# Altium schematic sheet BQ25895_Battery_Charger.SchDoc: BQ25895 Battery Charger
size A4; DocumentNumber: 3; SheetNumber: 3; SheetTotal: 50
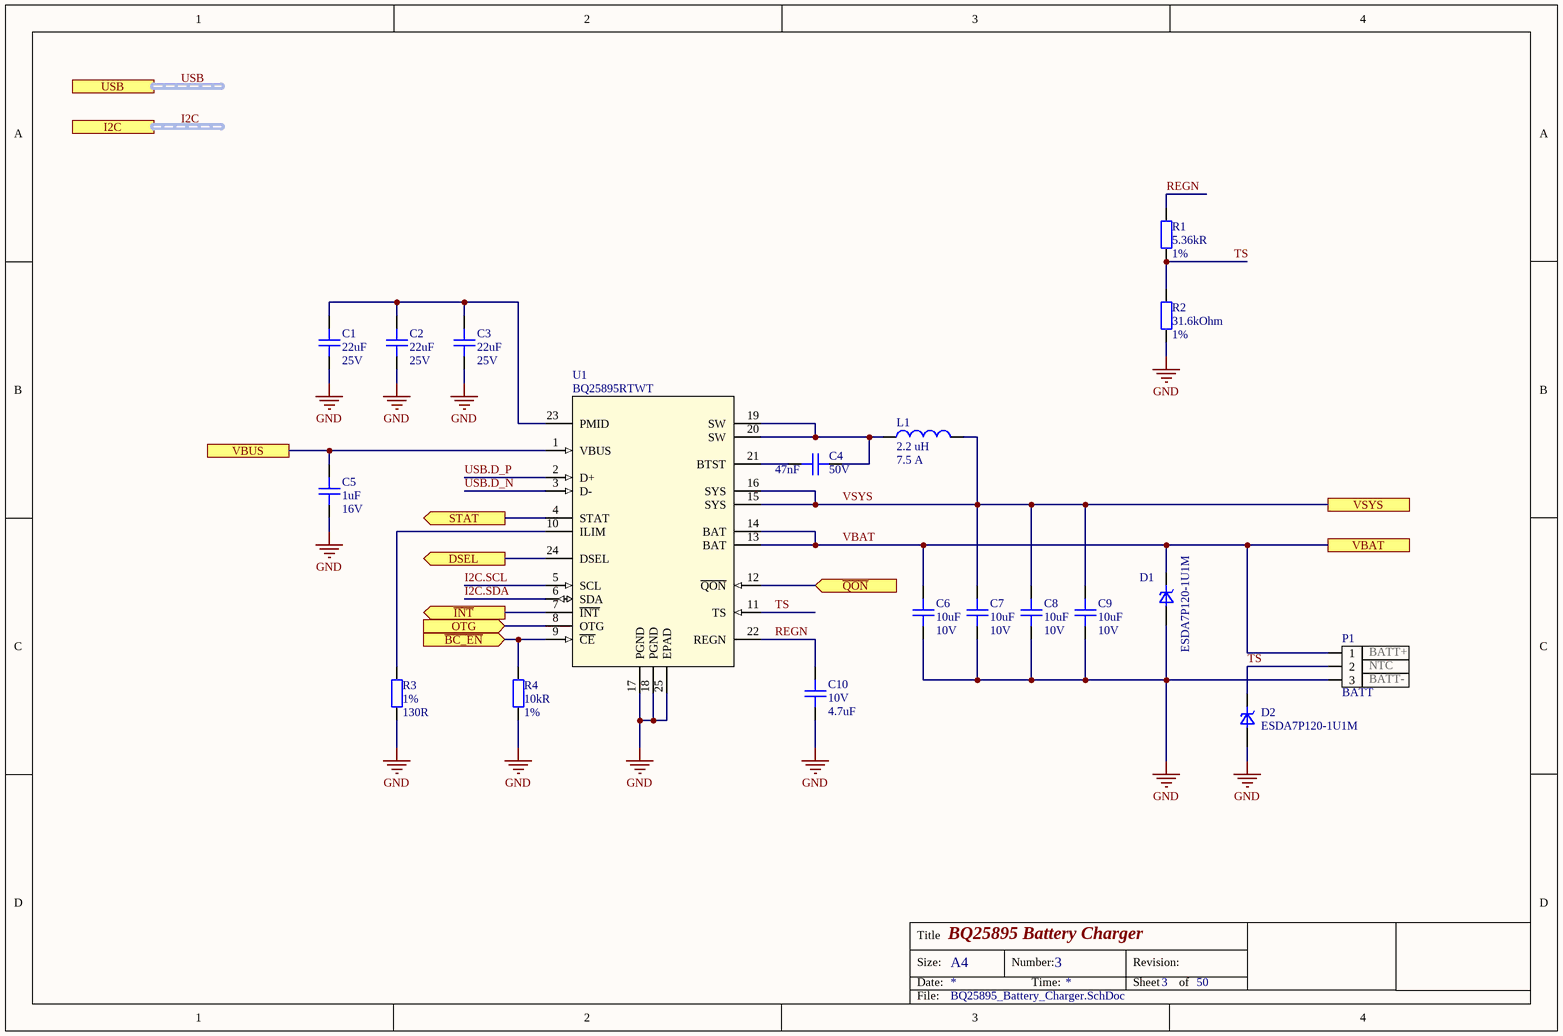
[diagram p0: BQ25895_Battery_Charger.SchDoc]

## Parts
C1  Capacitance: 22uF  Voltage Rating: 25V  [C0805]  (hidden comment: CAP CER 22UF 25V X5R 0805)
C2  Capacitance: 22uF  Voltage Rating: 25V  [C0805]  (hidden comment: CAP CER 22UF 25V X5R 0805)
C3  Capacitance: 22uF  Voltage Rating: 25V  [C0805]  (hidden comment: CAP CER 22UF 25V X5R 0805)
C4  Capacitance: 47nF  Voltage Rating: 50V  [C0402]  (hidden comment: CAP CER 0.047UF 50V X7R 0402)
C5  Capacitance: 1uF  Voltage Rating: 16V  [C0603]  (hidden comment: CAP CER 1UF 16V X5R 0603)
C6  Capacitance: 10uF  Voltage Rating: 10V  [C0805]  (hidden comment: CAP CER 10uF X7R 10% 0805)
C7  Capacitance: 10uF  Voltage Rating: 10V  [C0805]  (hidden comment: CAP CER 10uF X7R 10% 0805)
C8  Capacitance: 10uF  Voltage Rating: 10V  [C0805]  (hidden comment: CAP CER 10uF X7R 10% 0805)
C9  Capacitance: 10uF  Voltage Rating: 10V  [C0805]  (hidden comment: CAP CER 10uF X7R 10% 0805)
C10  Voltage Rating: 10V  Capacitance: 4.7uF  [C0603]  (hidden comment: CAP CER 4.7UF 10V X5R 0603)
D1  ESDA7P120-1U1M  [ST_QFN_1610]
D2  ESDA7P120-1U1M  [ST_QFN_1610]
L1  Inductance: 2.2 uH  Maximum DC Current: 7.5 A  [IND_WE_MAPI]  (hidden comment: FIXED IND 2.2UH 7.5A 16.1MOHM SM)
P1  BATT  pin_1: BATT+  pin_2: NTC  pin_3: BATT-  [CONN_JST_BM03B-AUHKS-GA-TB(LF)(SN)]
R1  Resistance: 5.36kR  Tolerance: 1%  [R0402]  (hidden comment: RES SMD 5.36K OHM 1% 1/16W 0402)
R2  Resistance: 31.6kOhm  Tolerance: 1%  [R0402]  (hidden comment: RES SMD 31.6K OHM 1% 1/16W 0402)
R3  Tolerance: 1%  Resistance: 130R  [R0402]  (hidden comment: RES SMD 130 OHM 1% 1/16W 0402)
R4  Resistance: 10kR  Tolerance: 1%  [R0402]  (hidden comment: RES SMD 10K OHM 1% 1/16W 0402)
U1  BQ25895RTWT  [WQFN-24]

## Ports
DSEL (out), I2C (harness I2C), OTG (in), STAT (out), USB (harness USB), VBAT, VBUS, VSYS, ~{BC_EN} (in), ~{INT} (out), ~{QON} (in)

## Nets
GND: C1.1 C2.1 C3.1 C5.2 C6.1 C7.1 C8.1 C9.1 C10.1 D1.2(A) D2.2(A) P1.3 R2.1 R3.2 R4.2 U1.17(PGND) U1.18(PGND) U1.25(EPAD)
~{BC_EN}: R4.1 U1.9(~{CE}) ; port ~{BC_EN}
~{INT}: U1.7(~{INT}) ; port ~{INT}
~{QON}: U1.12(~{QON}) ; port ~{QON}
DSEL: U1.24(DSEL) ; port DSEL
I2C.SCL: U1.5(SCL)
I2C.SDA: U1.6(SDA)
OTG: U1.8(OTG) ; port OTG
REGN: C10.2 R1.1 U1.22(REGN)
STAT: U1.4(STAT) ; port STAT
TS: D2.1(K) P1.2 R1.2 R2.2 U1.11(TS)
USB.D_N: U1.3(D-)
USB.D_P: U1.2(D+)
VBAT: C6.2 D1.1(K) P1.1 U1.13(BAT) U1.14(BAT) ; port VBAT
VBUS: C5.1 U1.1(VBUS) ; port VBUS
VSYS: C7.2 C8.2 C9.2 L1.2 U1.15(SYS) U1.16(SYS) ; port VSYS
NetC1_2: C1.2 C2.2 C3.2 U1.23(PMID)
NetC4_1: C4.1 U1.21(BTST)
NetC4_2: C4.2 L1.1 U1.19(SW) U1.20(SW)
NetR3_1: R3.1 U1.10(ILIM)

## Buses and harness runs
harness I2C = port I2C
harness USB = port USB

## Notes on the sheet
- Title
- Size:
- Date:
- A4
- Number:
- Time:
- Revision:
- Sheet
- of
- File:

## Library data of the parts
C1-C3 = CAP CER 22UF 25V X5R 0805: 22µF ±20% 25V Ceramic Capacitor X5R 0805 (2012 Metric); Manufacturer: Yageo; Manufacturer Part Number: CC0805MKX5R8BB226; Supplier 1: Digi-Key; Stock 1: 1060; Pricing 1: 1=0.5, 10=0.353, 50=0.267, 100=0.2325, 500=0.1722, 1000=0.1464 (USD); Mount: Surface Mount; Case/Package: 0805; Weight: 0.000194oz; Case Code (Metric): 2012; Case Code (Imperial): 0805; Min Operating Temperature: -55°C; Max Operating Temperature: 85°C; Packaging: Tape and Reel; Tolerance: 20%; Dielectric: X5R; Termination: SMD/SMT; Voltage Rating (DC): 25V; Package Quantity: 3000; Length: 0.079inch; Height: 1.25mm; Width: 0.049inch; Thickness: 0.057inch; Lead Free: Lead Free; Halogen Free: Halogen Free; ComponentLink1URL: http://www.yageo.com/documents/recent/UPY-GPHC_X5R_4V-to-50V_25.pdf?src-supplier=Digi-Key; ComponentLink1Description: http://www.yageo.com/documents/recent/UPY-GPHC_X5R_4V-to-50V_25.pdf?src-supplier=Digi-Key; ComponentLink2URL: http://www.mouser.com/ds/2/447/Yageo_UPY-GP_NP0_16V-to-50V_9-358835.pdf?src-supplier=Mouser; ComponentLink2Description: http://www.mouser.com/ds/2/447/Yageo_UPY-GP_NP0_16V-to-50V_9-358835.pdf?src-supplier=Mouser; Supplier Part Number 1: 311-1903-1-ND
C4 = CAP CER 0.047UF 50V X7R 0402: 0.047µF ±10% 50V Ceramic Capacitor X7R 0402 (1005 Metric); Manufacturer: TDK; Manufacturer Part Number: CGA2B3X7R1H473K050BB; Supplier 1: Digi-Key; Stock 1: 1255429; Pricing 1: 1=0.11, 10=0.083, 50=0.045, 100=0.0368, 500=0.0263, 1000=0.0207, 2500=0.0188, 5000=0.0173 (USD); Mount: Surface Mount; Case/Package: 0402; Weight: 2.3E-05oz; Case Code (Metric): 1005; Case Code (Imperial): 0402; Min Operating Temperature: -55°C; Max Operating Temperature: 125°C; Tolerance: 10%; Dielectric: X7R; Voltage Rating (DC): 50V; Packaging: Tape and Reel; Termination: SMD/SMT; Package Quantity: 1; Composition: Ceramic; Length: 1mm; Height: 0.5mm; Width: 0.02inch; Thickness: 0.022inch; Depth: 0.5mm; Ratings: AEC-Q200; Radiation Hardening: No; Lead Free: Lead Free; REACH SVHC: No SVHC; ComponentLink1URL: http://www.farnell.com/datasheets/1807242.pdf?src-supplier=Element14; ComponentLink1Description: http://www.farnell.com/datasheets/1807242.pdf?src-supplier=Element14; ComponentLink2URL: http://www.farnell.com/datasheets/1735392.pdf?src-supplier=Element14; ComponentLink2Description: http://www.farnell.com/datasheets/1735392.pdf?src-supplier=Element14; ComponentLink3URL: http://www.mouser.com/ds/2/400/lcc_automotive_general_en-843974.pdf?src-supplier=Mouser; ComponentLink3Description: http://www.mouser.com/ds/2/400/lcc_automotive_general_en-843974.pdf?src-supplier=Mouser; Supplier Part Number 1: 445-6897-1-ND
C5 = CAP CER 1UF 16V X5R 0603: 1µF ±10% 16V Ceramic Capacitor X5R 0603 (1608 Metric); Manuf_Part_1: CC0603KRX5R7BB105; Manuf_1: YAGEO; Dissipation Factor: 7%; Revision: July-2002: Re-released for DXP Platform.; Order: CC0603KRX5R7BB105; Supplier 1: Digi-Key; Manufacturer: Yageo; Manufacturer Part Number: CC0603KRX5R7BB105; Stock 1: 2299176; Pricing 1: 1=0.11, 10=0.081, 100=0.0382, 500=0.0268, 1000=0.0222 (USD); Mount: Surface Mount; Number of Pins: 2; Case Code (Imperial): 0603; Case Code (Metric): 1608; Min Operating Temperature: -55°C; Max Operating Temperature: 85°C; Tolerance: 10%; Dielectric: X5R; Voltage Rating (DC): 16V; Packaging: Tape and Reel; Package Quantity: 4000; Termination: SMD/SMT; Composition: Ceramic; Length: 1.6mm; Height: 0.8mm; Width: 0.8mm; Thickness: 0.035inch; Depth: 0.8mm; Radiation Hardening: No; REACH SVHC: Unknown; Lead Free: Lead Free; Halogen Free: Halogen Free; ComponentLink1URL: https://www.verical.com/server-webapp/html/getDatasheet?partID=317657&src-supplier=Verical; ComponentLink1Description: https://www.verical.com/server-webapp/html/getDatasheet?partID=317657&src-supplier=Verical; ComponentLink2URL: http://www.yageo.com/documents/recent/UPY-GPHC_X5R_4V-to-50V_25.pdf?src-supplier=Digi-Key; ComponentLink2Description: http://www.yageo.com/documents/recent/UPY-GPHC_X5R_4V-to-50V_25.pdf?src-supplier=Digi-Key; ComponentLink3URL: http://www.farnell.com/datasheets/1525783.pdf?src-supplier=Element14; ComponentLink3Description: http://www.farnell.com/datasheets/1525783.pdf?src-supplier=Element14; ComponentLink4URL: http://www.farnell.com/datasheets/1359354.pdf?src-supplier=Element14; ComponentLink4Description: http://www.farnell.com/datasheets/1359354.pdf?src-supplier=Element14; ComponentLink5URL: http://www.yageo.com/documents/recent/UPY-GPHC_X5R_4V-to-50V_12.pdf?src-supplier=Avnet; ComponentLink5Description: http://www.yageo.com/documents/recent/UPY-GPHC_X5R_4V-to-50V_12.pdf?src-supplier=Avnet; Supplier Part Number 1: 311-1444-1-ND; Value: 1uF; Case/Package: 0603
C6-C9 = CAP CER 10uF X7R 10% 0805: Capacitor,10uF,10V,X7R,10%,0805,Murata; Manufacturer Part Number: GRM21BR71A106KA73L; Supplier 1: Digi-Key; Manufacturer: Murata; Stock 1: 2099435; Pricing 1: 1=0.26, 10=0.176, 100=0.089, 500=0.0609, 1000=0.0538 (USD); Mount: Surface Mount; Case/Package: 0805; Case Code (Imperial): 0805; Case Code (Metric): 2012; Min Operating Temperature: -55°C; Max Operating Temperature: 125°C; Tolerance: 10%; Dielectric: X7R; Voltage Rating (DC): 10V; Packaging: Tape and Reel; Package Quantity: 3000; Termination: SMD/SMT; Length: 2mm; Height: 1.25mm; Width: 1.25mm; Thickness: 0.055inch; Depth: 1.25mm; REACH SVHC: No SVHC; ComponentLink1URL: http://components.arrow.com/part/dataview/0323_07281730?src-supplier=Arrow+Europe; ComponentLink1Description: http://components.arrow.com/part/dataview/0323_07281730?src-supplier=Arrow+Europe; ComponentLink2URL: http://www.mouser.com/ds/2/281/c02e-2905.pdf?src-supplier=Mouser; ComponentLink2Description: http://www.mouser.com/ds/2/281/c02e-2905.pdf?src-supplier=Mouser; ComponentLink3URL: http://www.farnell.com/datasheets/2079188.pdf?src-supplier=Newark; ComponentLink3Description: http://www.farnell.com/datasheets/2079188.pdf?src-supplier=Newark; ComponentLink4URL: http://www.farnell.com/datasheets/2079188.pdf?src-supplier=Farnell; ComponentLink4Description: http://www.farnell.com/datasheets/2079188.pdf?src-supplier=Farnell; ComponentLink5URL: http://www.farnell.com/datasheets/2079188.pdf?src-supplier=Element14; ComponentLink5Description: http://www.farnell.com/datasheets/2079188.pdf?src-supplier=Element14; Supplier Part Number 1: 490-10516-1-ND; Weight: 0.000335oz; ComponentLink6URL: http://search.murata.co.jp/Ceramy/image/img/A01X/G101/ENG/GRM21BR71A106KA73-01.pdf?src-supplier=Digi-Key; ComponentLink6Description: http://search.murata.co.jp/Ceramy/image/img/A01X/G101/ENG/GRM21BR71A106KA73-01.pdf?src-supplier=Digi-Key
C10 = CAP CER 4.7UF 10V X5R 0603: 4.7µF ±10% 10V Ceramic Capacitor X5R 0603 (1608 Metric); Manufacturer: Yageo; Manufacturer Part Number: CC0603KRX5R6BB475; Supplier 1: Digi-Key; Stock 1: 325858; Pricing 1: 1=0.26, 10=0.18, 100=0.102, 500=0.072, 1000=0.063 (USD); Mount: Surface Mount; Case Code (Imperial): 0603; Case Code (Metric): 1608; Min Operating Temperature: -55°C; Max Operating Temperature: 85°C; Voltage Rating (DC): 10V; Tolerance: 10%; Packaging: Tape and Reel; Package Quantity: 1; Dielectric: X5R; Termination: SMD/SMT; Composition: Ceramic; Length: 1.6mm; Height: 0.8mm; Width: 0.8mm; Thickness: 0.035inch; Depth: 0.8mm; Radiation Hardening: No; REACH SVHC: Unknown; Lead Free: Lead Free; Halogen Free: Halogen Free; ComponentLink1URL: http://www.farnell.com/datasheets/2167237.pdf?src-supplier=Element14; ComponentLink1Description: http://www.farnell.com/datasheets/2167237.pdf?src-supplier=Element14; ComponentLink2URL: http://www.yageo.com/documents/recent/UPY-GPHC_X5R_4V-to-50V_25.pdf?src-supplier=Digi-Key; ComponentLink2Description: http://www.yageo.com/documents/recent/UPY-GPHC_X5R_4V-to-50V_25.pdf?src-supplier=Digi-Key; ComponentLink3URL: http://www.yageo.com/documents/recent/UPY-GPHC_X5R_4V-to-50V_12.pdf?src-supplier=Avnet; ComponentLink3Description: http://www.yageo.com/documents/recent/UPY-GPHC_X5R_4V-to-50V_12.pdf?src-supplier=Avnet; ComponentLink4URL: http://www.yageo.com/documents/recent/UPY-GPHC_X5R_4V-to-50V_12.pdf?src-supplier=Avnet+Europe; ComponentLink4Description: http://www.yageo.com/documents/recent/UPY-GPHC_X5R_4V-to-50V_12.pdf?src-supplier=Avnet+Europe; Supplier Part Number 1: 311-1455-1-ND; Case/Package: 0603
D1 D2 = TVS DIODE ESDA7P120-1U1M 5.5V 11.5V 1610: 11.5V Clamp 120A (8/20µs) Ipp Tvs Diode Surface Mount 1610; Manufacturer: STMicroelectronics; Reverse Standoff Voltage: 5.5V; Number of Unidirectional Channels: 1; Min Breakdown Voltage: 6.4V; Peak Pulse Power: 1.4kW; Power Line Protection: No; Supplier 1: Digi-Key; Manufacturer Part Number: ESDA7P120-1U1M; Stock 1: 15775; Pricing 1: 1=0.35, 10=0.287, 25=0.2624, 100=0.1647, 250=0.1629, 500=0.1525, 1000=0.1037, 2500=0.0994 (USD); Packaging: Cut Tape; ComponentLink1URL: http://www.st.com/content/ccc/resource/technical/document/datasheet/group3/5e/7c/5d/76/3f/de/45/35/DM00359316/files/DM00359316.pdf/jcr:content/translations/en.DM00359316.pdf?src-supplier=Digi-Key; ComponentLink1Description: http://www.st.com/content/ccc/resource/technical/document/datasheet/group3/5e/7c/5d/76/3f/de/45/35/DM00359316/files/DM00359316.pdf/jcr:content/translations/en.DM00359316.pdf?src-supplier=Digi-Key; Supplier Part Number 1: 497-17159-1-ND; Mount: Surface Mount; Case/Package: 0603; Case Code (Imperial): 0603; Case Code (Metric): 1610; Min Operating Temperature: -55°C; Max Operating Temperature: 150°C; Composition: Zener; Clamping Voltage: 11.5V; Peak Pulse Current: 120A; ComponentLink2URL: http://www.farnell.com/datasheets/2815837.pdf?src-supplier=Newark; ComponentLink2Description: http://www.farnell.com/datasheets/2815837.pdf?src-supplier=Newark; ComponentLink3URL: http://www.farnell.com/datasheets/2815837.pdf?src-supplier=Farnell; ComponentLink3Description: http://www.farnell.com/datasheets/2815837.pdf?src-supplier=Farnell; ComponentLink4URL: http://www.farnell.com/datasheets/2815837.pdf?src-supplier=Element14; ComponentLink4Description: http://www.farnell.com/datasheets/2815837.pdf?src-supplier=Element14
L1 = FIXED IND 2.2UH 7.5A 16.1MOHM SM: 2.2 µH Shielded - Inductor 7.5 A 16.1mOhm Max Nonstandard -; Manufacturer: Wurth Elektronik; Manufacturer Part Number: 74438367022; Self Resonant Frequency: 28 MHz; Tolerance: 20 %; RoHS: RoHS Compliant; Category: Fixed Inductors; Stock 1: 2000; Pricing 1: 1=0.730, 10=0.721, 50=0.601, 100=0.457, 1000=0.397, 2000=0.385 (USD); Application: Power; Height: 3.1 mm; Length: 5.4 mm; Maximum DC Resistance: 16.1 mOhms; Packaging: Cut Tape; Product: Fixed Inductors; Series: WE-MAPI; Shielding: Shielded; Termination Style: SMD/SMT; Width: 5.4 mm; Brand: Wurth Elektronik; Mounting Style: PCB Mount; Maximum Operating Temperature: + 125 C; Minimum Operating Temperature: - 40 C; Product Type: Fixed Inductors; Saturation Current: 7.5 A; Standard Pack Qty: 700; Subcategory: Inductors, Chokes & Coils; Termination: -; RoHS - Mouser: Y; Minimum Order Quantity: 1; Reeling: True; ComponentLink1URL: https://www.digikey.com/en/products/detail/würth-elektronik/74438367022/11657904?s=N4IgTCBcDaIOwBYEGYAcyBscAMYIF0BfIA; ComponentLink1Description: https://www.digikey.com/en/products/detail/würth-elektronik/74438367022/11657904?s=N4IgTCBcDaIOwBYEGYAcyBscAMYIF0BfIA; Supplier 2: Digi-Key; Supplier Part Number 1: 732-74438367022TR-ND; Mount: Surface Mount
P1 = CONN HEADER SMD R/A 3POS: Connector Header Surface Mount, Right Angle 3 position; Manufacturer: JST; Manufacturer Part Number: BM03B-AUHKS-GA-TB(LF)(SN); Number of Positions: 3; Connector Type: Male Pin; Contact Resistance: 20mR; Current Rating: 5A; Voltage Rating: 30V; Gender: Male; Pitch: 2mm; Supplier 1: Digi-Key; Stock 1: 0; Mount: Surface Mount; Color: Natural; Contact Plating: Tin,Copper; Contact Material: Brass,Tin; Housing Material: Polyamide; Housing Color: Beige; Min Operating Temperature: -25°C; Max Operating Temperature: 85°C; Number of Rows: 1; Packaging: Tape and Reel; Series: AUX; Contact Type: Male Pin; Termination: Solder; Max Current Rating: 5A; Fastening Type: Detent; Max Voltage Rating (AC): 30V; Number of Contacts: 3; Orientation: Right Angle; REACH SVHC: Unknown; Lead Free: Lead Free; ComponentLink1URL: https://www.digikey.com/en/products/detail/jst-sales-america-inc/BM03B-AUHKS-GA-TB-LF-SN/5272486?s=N4IgTCBcDaIEIFkAMBmOBaAggVQBIGkBldAcU3QBU4AKAGQDEBKawgOUZAF0BfIA; ComponentLink1Description: https://www.digikey.com/en/products/detail/jst-sales-america-inc/BM03B-AUHKS-GA-TB-LF-SN/5272486?s=N4IgTCBcDaIEIFkAMBmOBaAggVQBIGkBldAcU3QBU4AKAGQDEBKawgOUZAF0BfIA; Supplier Part Number 1: 455-2901-2-ND
R1 = RES SMD 5.36K OHM 1% 1/16W 0402: 5.36 kOhms ±1% 0.063W, 1/16W Chip Resistor 0402 (1005 Metric) Moisture Resistant Thick Film; Manufacturer Part Number: RC0402FR-075K36L; Manufacturer: Yageo; Temperature Coefficient: 100ppm/°C; Voltage Rating (DC): 50V; Power Rating: 62.5mW; Max Power Dissipation: 63mW; Supplier 1: Digi-Key; Stock 1: 170749; Pricing 1: 1=0.1, 10=0.016, 100=0.0064, 1000=0.0029, 2500=0.0025, 5000=0.0021 (USD); Case Code (Imperial): 0402; Case Code (Metric): 1005; Min Operating Temperature: -55°C; Max Operating Temperature: 155°C; Composition: Thick Film; Packaging: Tape and Reel; Voltage Rating: 50V; Termination: SMD/SMT; Military Standard: Not; Number of Terminations: 2; Length: 1mm; Height: 0.016inch; Width: 0.02inch; Depth: 0.5mm; Lead Free: Lead Free; ComponentLink1URL: https://www.verical.com/server-webapp/html/getDatasheet?partID=314179&src-supplier=Verical; ComponentLink1Description: https://www.verical.com/server-webapp/html/getDatasheet?partID=314179&src-supplier=Verical; ComponentLink2URL: http://www.yageo.com/pdf/PYu-RC0402_51_RoHS_L_4.pdf?src-supplier=Avnet; ComponentLink2Description: http://www.yageo.com/pdf/PYu-RC0402_51_RoHS_L_4.pdf?src-supplier=Avnet; ComponentLink3URL: http://www.yageo.com/documents/recent/PYu-RC_Group_51_RoHS_L_10.pdf?src-supplier=Digi-Key; ComponentLink3Description: http://www.yageo.com/documents/recent/PYu-RC_Group_51_RoHS_L_10.pdf?src-supplier=Digi-Key; ComponentLink4URL: http://www.yageo.com/documents/recent/PYu-RC0402_51_RoHS_L_6_r.pdf?src-supplier=Mouser; ComponentLink4Description: http://www.yageo.com/documents/recent/PYu-RC0402_51_RoHS_L_6_r.pdf?src-supplier=Mouser; Supplier Part Number 1: 311-5.36KLRCT-ND; Case/Package: 0402; Package Quantity: 1; Features: Moisture Resistant; ComponentLink5URL: http://www.yageo.com/documents/recent/PYu-RC0402_51_RoHS_L_6.pdf?src-supplier=Avnet+Europe; ComponentLink5Description: http://www.yageo.com/documents/recent/PYu-RC0402_51_RoHS_L_6.pdf?src-supplier=Avnet+Europe; Contact Plating: Tin,Lead,Matte; Radiation Hardening: No; Mount: Surface Mount
R2 = RES SMD 31.6K OHM 1% 1/16W 0402: 31.6 kOhms ±1% 0.063W, 1/16W Chip Resistor 0402 (1005 Metric) Moisture Resistant Thick Film; Manufacturer Part Number: RC0402FR-0731K6L; Manufacturer: Yageo; Temperature Coefficient: 100ppm/°C; Voltage Rating (DC): 50V; Power Rating: 62.5mW; Max Power Dissipation: 63mW; Supplier 1: Digi-Key; Stock 1: 2889310; Pricing 1: 1=0.1, 10=0.016, 100=0.0064, 1000=0.0029, 2500=0.0025, 5000=0.0021 (USD); Case Code (Imperial): 0402; Case Code (Metric): 1005; Min Operating Temperature: -55°C; Max Operating Temperature: 155°C; Composition: Thick Film; Packaging: Tape and Reel; Voltage Rating: 50V; Termination: SMD/SMT; Military Standard: Not; Number of Terminations: 2; Length: 1mm; Height: 0.016inch; Width: 0.02inch; Depth: 0.5mm; Lead Free: Lead Free; ComponentLink1URL: http://www.yageo.com/documents/recent/PYu-RC0402_51_RoHS_L_6_r.pdf?src-supplier=Future+Electronics; ComponentLink1Description: http://www.yageo.com/documents/recent/PYu-RC0402_51_RoHS_L_6_r.pdf?src-supplier=Future+Electronics; ComponentLink2URL: http://www.yageo.com/documents/recent/PYu-RC0402_51_RoHS_L_6_r.pdf?src-supplier=Mouser; ComponentLink2Description: http://www.yageo.com/documents/recent/PYu-RC0402_51_RoHS_L_6_r.pdf?src-supplier=Mouser; Supplier Part Number 1: YAG3115CT-ND; Case/Package: 0402; Weight: 10.729601oz; Package Quantity: 10000; Features: Moisture Resistant; Mount: Surface Mount
R3 = RES SMD 130 OHM 1% 1/16W 0402: 130 Ohms ±1% 0.063W, 1/16W Chip Resistor 0402 (1005 Metric) Moisture Resistant Thick Film; Manufacturer: Yageo; Manufacturer Part Number: RC0402FR-07130RL; Power Rating: 62.5mW; Voltage Rating: 50V; Temperature Coefficient: 100ppm/°C; Supplier 1: Digi-Key; Stock 1: 16989760; Pricing 1: 1=0.1, 10=0.016, 100=0.0064, 1000=0.0029, 2500=0.0025, 5000=0.0021 (USD); Case/Package: 0402; Number of Pins: 2; Case Code (Imperial): 0402; Case Code (Metric): 1005; Min Operating Temperature: -55°C; Max Operating Temperature: 155°C; Voltage Rating (DC): 50V; Packaging: Tape and Reel; Termination: SMD/SMT; Composition: Thick Film; Military Standard: Not; Length: 1mm; Height: 0.32mm; Width: 0.5mm; Depth: 0.5mm; REACH SVHC: No SVHC; Lead Free: Lead Free; ComponentLink1URL: https://www.digikey.com/en/products/detail/yageo/RC0402FR-07130RL/2827588?s=N4IgTCBcDaIEoGEAMAWJYBicC0SDsAjAMxJwAyIAugL5A; ComponentLink1Description: https://www.digikey.com/en/products/detail/yageo/RC0402FR-07130RL/2827588?s=N4IgTCBcDaIEoGEAMAWJYBicC0SDsAjAMxJwAyIAugL5A; Supplier Part Number 1: 311-130LRTR-ND
R4 = RES SMD 10K OHM 1% 1/16W 0402: 10 kOhms ±1% 0.063W, 1/16W Chip Resistor 0402 (1005 Metric) Moisture Resistant Thick Film; Manufacturer Part Number: RC0402FR-0710KP; Manufacturer: Yageo; Temperature Coefficient: 150ppm/°C; Max Power Dissipation: 63mW; Supplier 1: Digi-Key; Stock 1: 839368; Pricing 1: 1=0.1, 10=0.035, 100=0.014, 1000=0.0063, 2500=0.0055, 5000=0.0045 (USD); Case Code (Imperial): 0402; Case Code (Metric): 1005; Min Operating Temperature: -55°C; Max Operating Temperature: 155°C; Composition: Thick Film; Packaging: Tape and Reel; Number of Terminations: 2; Length: 0.039inch; Height: 0.016inch; Width: 0.02inch; ComponentLink1URL: http://www.yageo.com/NewPortal/yageodocoutput?fileName=/pdf/R-Chip/PYu-RC_51_RoHS_P_0.pdf&src-supplier=Digi-Key; ComponentLink1Description: http://www.yageo.com/NewPortal/yageodocoutput?fileName=/pdf/R-Chip/PYu-RC_51_RoHS_P_0.pdf&src-supplier=Digi-Key; Supplier Part Number 1: YAG1249CT-ND; Case/Package: 0402; Features: Moisture Resistant; Mount: Surface Mount
U1 = IC BQ25895RTWT BATT CHG LI-ION 1CELL 24WQFN: Charger IC Lithium Ion/Polymer 24WQFN (4x4); Manufacturer: Texas Instruments; Product Status: New Product; Manufacturer Part Number: BQ25895RTWT; RoHS: RoHS Compliant; Category: Battery Management; Stock 1: 208; Pricing 1: 1=4.41, 10=3.96, 100=3.34, 250=2.91, 500=2.76, 1000=2.33, 2500=2.21, 5000=2.13 (USD); Packaging: Cut Tape; Brand: Texas Instruments; Moisture Sensitive: Yes; Product Type: Battery Management; Standard Pack Qty: 250; Subcategory: PMIC - Power Management ICs; RoHS - Mouser: Y; Minimum Order Quantity: 1; Reeling: True; ComponentLink1URL: https://www.digikey.com/en/products/detail/texas-instruments/BQ25895RTWT/5218154; ComponentLink1Description: https://www.digikey.com/en/products/detail/texas-instruments/BQ25895RTWT/5218154; Supplier Part Number 1: 296-41132-2-ND; Mount: Surface Mount